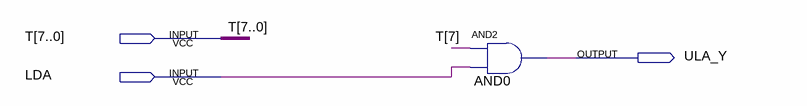
[diagram p0: schematic sheet]
// Quartus schematic ULA_Y.bdf as structural Verilog: 1 symbols, 3 pins
module ULA_Y (
  input  [7:0] T,
  input  LDA,
  output ULA_Y
);

  and AND0 (ULA_Y, T[7], LDA);
endmodule
